# EAGLE schematic sample_schematic (EAGLE 9.6.2)
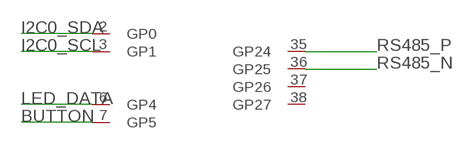
[diagram p0: schematic, sheet 1]

## Parts
U1  RP2040  [RP2040-QFN-56]

## Nets
BUTTON: U1.7(GP5)
I2C0_SCL: U1.3(GP1)
I2C0_SDA: U1.2(GP0)
LED_DATA: U1.6(GP4)
RS485_N: U1.36(GP25)
RS485_P: U1.35(GP24)
Unconnected: U1.37(GP26) U1.38(GP27)

## Library data of the parts
U1 = rp2040:RP2040